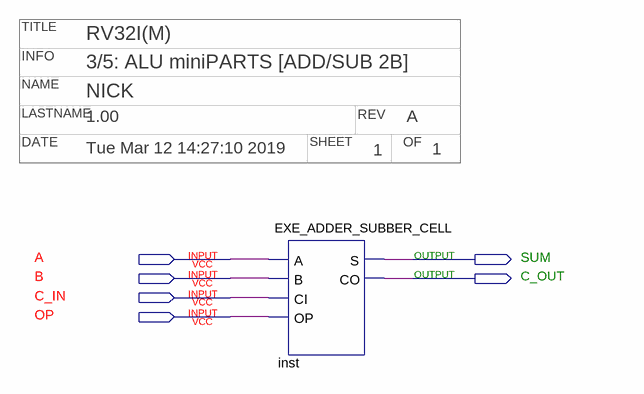
[diagram p0: schematic sheet]
// Quartus schematic EXE_ADDER_SUBBER_CELLTEST.bdf as structural Verilog: 1 symbols, 6 pins
// Title block: TITLE: RV32I(M); INFO: 3/5: ALU miniPARTS [ADD/SUB 2B]; NAME: NICK; LASTNAME: 1.00; REV: A; DATE: Tue Mar 12 14:27:10 2019; SHEET: 1; OF: 1
module EXE_ADDER_SUBBER_CELLTEST (
  input  A,
  input  B,
  input  C_IN,
  input  OP,
  output SUM,
  output C_OUT
);

  EXE_ADDER_SUBBER_CELL inst (.A(A), .B(B), .CI(C_IN), .OP(OP), .S(SUM), .CO(C_OUT));
endmodule
